# Altium schematic sheet overdischarge_protection.SchDoc
size A4
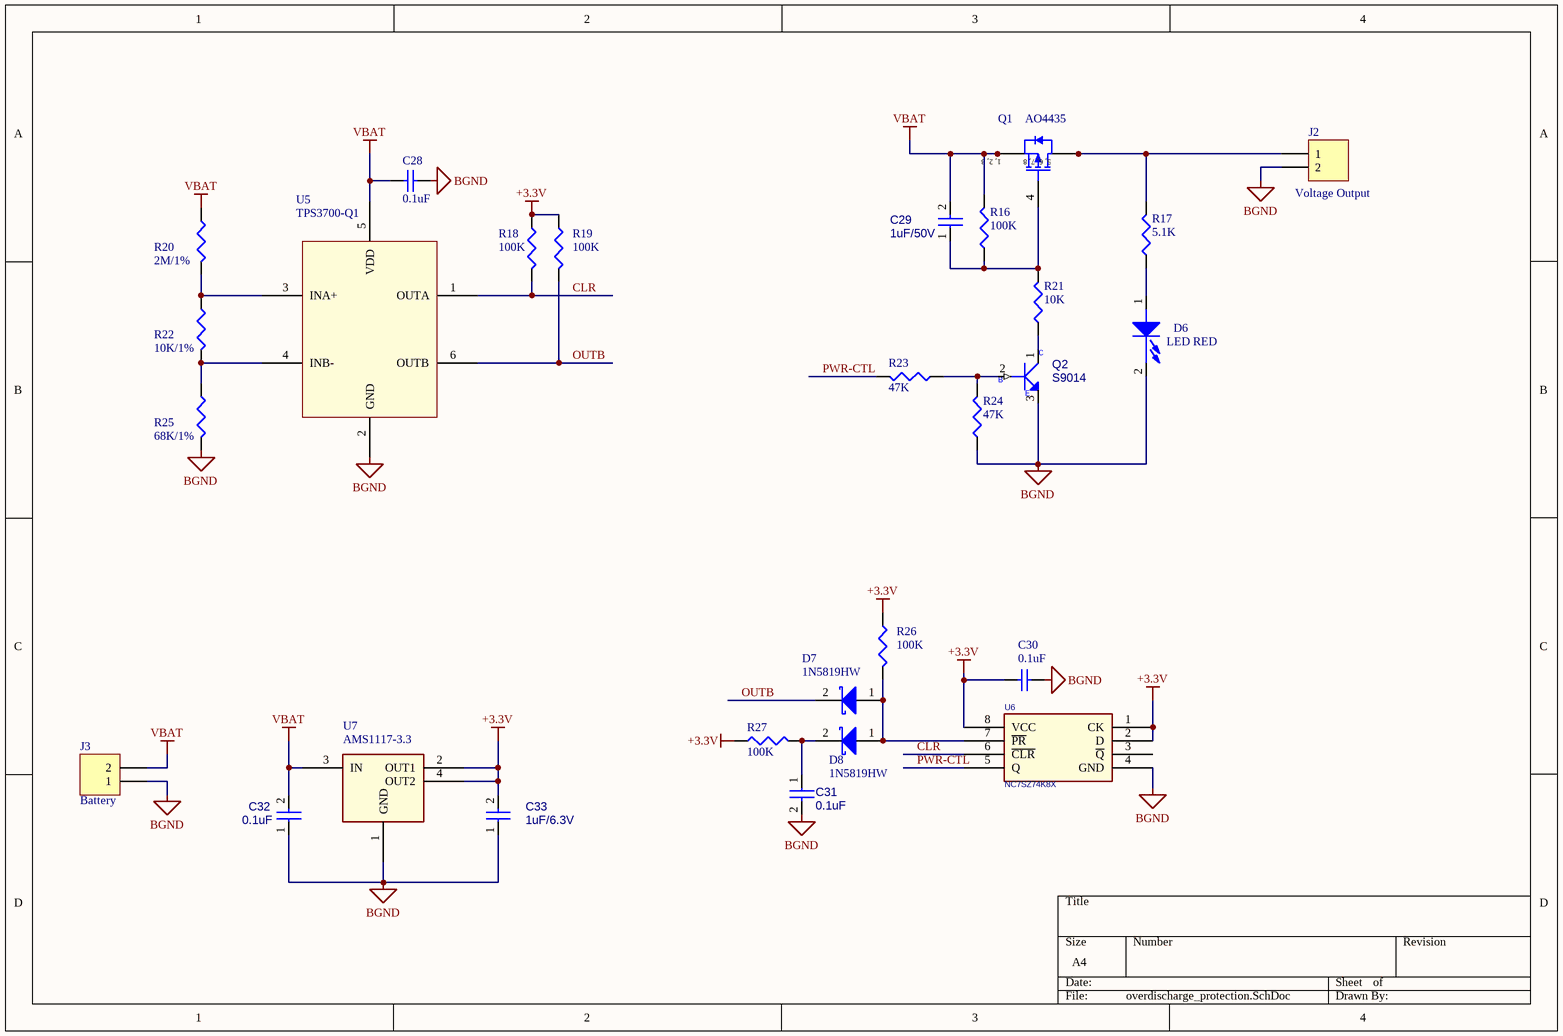
[diagram p0: overdischarge_protection.SchDoc]

## Parts
C28  0.1uF  [0603]
C29  1uF/50V  [1210]
C30  0.1uF  [0603]
C31  0.1uF  [0603]
C32  0.1uF  [0603]
C33  1uF/6.3V  [0603]
D6  LED RED  [LED0603]
D7  1N5819HW  [1N5819]
D8  1N5819HW  [1N5819]
J2  Voltage Output  [T-2PIN]
J3  Battery  [T-2PIN]
Q1  AO4435  [SO8]
Q2  S9014  [NPN]
R16  100K  [0603]
R17  5.1K  [0603]
R18  100K  [0603]
R19  100K  [0603]
R20  2M/1%  [0603]
R21  10K  [0603]
R22  10K/1%  [0603]
R23  47K  [0603]
R24  47K  [0603]
R25  68K/1%  [0603]
R26  100K  [0603]
R27  100K  [0603]
U5  TPS3700-Q1  [SOT23-6]
U6  NC7SZ74K8X  [US8]
U7  AMS1117-3.3  [AMS1117]

## Nets
+3.3V: C30.2 C33.2 R18.1 R19.1 R26.1 R27.1 U6.1(CK) U6.2(D) U6.8(VCC) U7.2(OUT1) U7.4(OUT2)
BGND: C28.1 C30.1 C31.2 C32.1 C33.1 D6.2(CATHODE) J2.2 J3.1 Q2.3(EMITTER) R24.1 R25.2 U5.2(GND) U6.4(GND) U7.1(GND)
VBAT: C28.2 C29.2 C32.2 J3.2 Q1.1(S) Q1.2(S) Q1.3(S) R16.2 R20.1 U5.5(VDD) U7.3(IN)
CLR: R18.2 U5.1(OUTA) U6.6(~{CLR})
OUTB: D7.2(K) R19.2 U5.6(OUTB)
PWR-CTL: R23.2 U6.5(Q)
NetC29_1: C29.1 Q1.4(G) R16.1 R21.2
NetC31_1: C31.1 D8.2(K) R27.2
NetD6_1: D6.1(ANODE) R17.1
NetD7_1: D7.1(A) D8.1(A) R26.2 U6.7(~{PR})
NetJ2_1: J2.1 Q1.5(D) Q1.6(D) Q1.7(D) Q1.8(D) R17.2
NetQ2_1: Q2.1(COLLECTOR) R21.1
NetQ2_2: Q2.2(BASE) R23.1 R24.2
NetR20_2: R20.2 R22.1 U5.3(INA+)
NetR22_2: R22.2 R25.1 U5.4(INB-)

Not connected (* = marked no-connect by the designer): U6 3(~{Q})

## Notes on the sheet
- (in symbol MMBT3904_NL_SOT23-3) C; B; E
- (in symbol SI4431DY) 1, 2, 3; 5, 6, 7, 8

## Library data of the parts
C28 C30 = Cap: Capacitor; Published: 8-Jun-2000; LatestRevisionDate: 17-Jul-2002; LatestRevisionNote: Re-released for DXP Platform.; PackageReference: RAD-0.3; Publisher: Altium Limited; PackageDescription: Radial Cap, Thru-Hole; 2 Leads; 0.3 in Pin Spacing; Value: 0.1uF
C29 C31-C33 = CAP NP_Dup2
D6 = LN01401_1
D7 D8 = Diode 11DQ03: Schottky Rectifier
J2 J3 = Header 2: Header, 2-Pin; LatestRevisionDate: 17-Jul-2002; LatestRevisionNote: Re-released for DXP Platform.; Publisher: Altium Limited
Q1 = SI4431DY: P-Channel 30V (D-S)  MOSFET; Published: 8-Jun-2000; LatestRevisionDate: 13-Apr-2006; LatestRevisionNote: IPC-7351 Footprint Added.; DatasheetVersion: 6-Oct-1997; PackageVersion: Aug-1998; PackageReference: SO-8; Publisher: Altium Limited; PackageDescription: 8-Pin Small Outline Integrated Circuit 1.27 mm Pitch; ComponentLink1Description: Manufacturer Link; ComponentLink1URL: http://www.vishay.com/; ComponentLink2Description: Datasheet; ComponentLink2URL: http://www.vishay.com/docs/70151/70151.pdf
Q2 = MMBT3904_NL_SOT23-3: Part Description: S TR MMBT3904_NL NPN SOT23; Part Number: SB039040000
R16 R17 R21 R23 R24 = CR16-1003FM
R18-R20 R22 R25-R27 = Res3: Resistor; Value: 1K; Published: 8-Jun-2000; LatestRevisionDate: 29-May-2009; LatestRevisionNote: IPC-7351 Footprint Added.; PackageReference: J1-0603; Publisher: Altium Limited; PackageDescription: Chip Resistor
U6 = NC7SZ74-US8_0: IC;NC7SZ74,D-TYPE FLIP-FLOP,US8; VENDER: FAIRCHILD; P/N: XXXXXXXXXXXX; PKG: US8; device: US8
U7 = LT1963EST-1_4.8